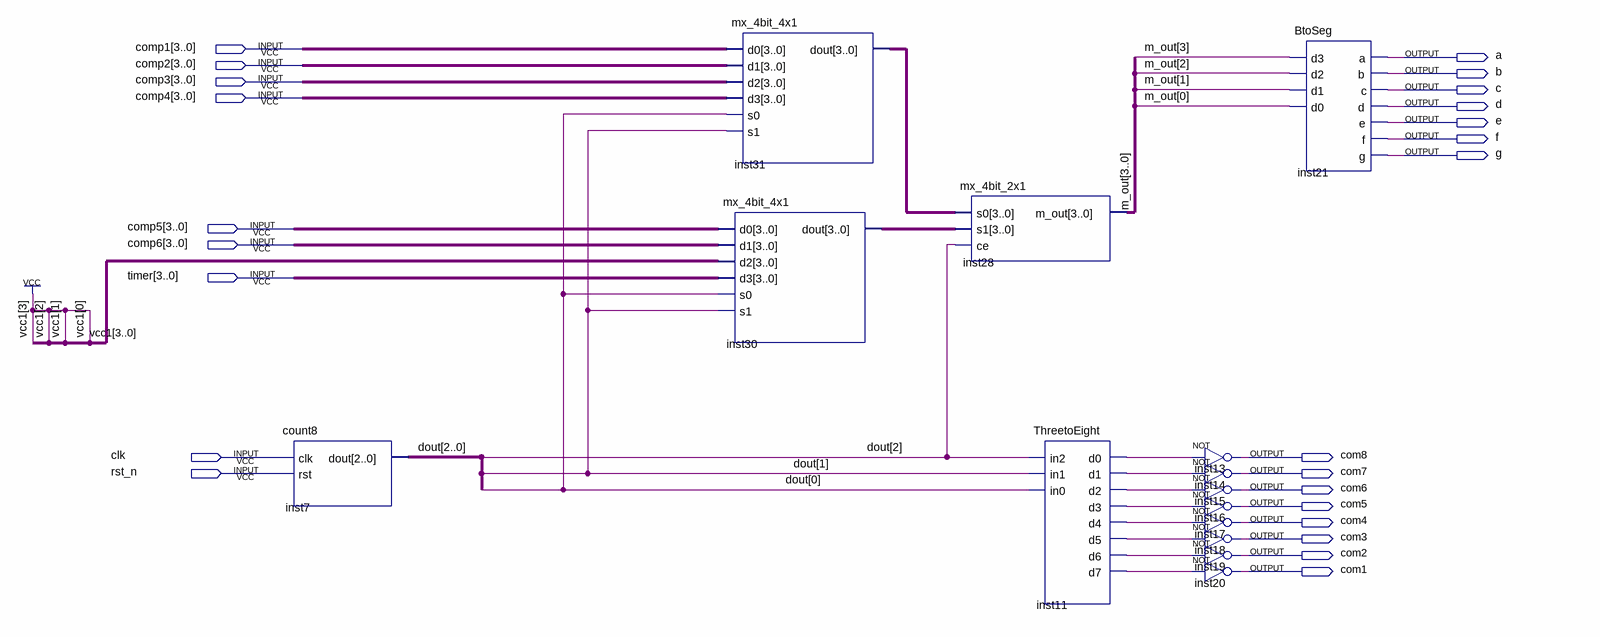
[diagram p0: schematic sheet]
// Quartus schematic segment.bdf as structural Verilog: 14 symbols, 24 pins
module segment (
  input  [3:0] comp1,
  input  [3:0] comp2,
  input  [3:0] comp3,
  input  [3:0] comp4,
  input  [3:0] comp5,
  input  [3:0] comp6,
  input  [3:0] timer,
  input  clk,
  input  rst_n,
  output a,
  output b,
  output c,
  output d,
  output e,
  output f,
  output g,
  output com8,
  output com7,
  output com6,
  output com5,
  output com4,
  output com3,
  output com2,
  output com1
);

  wire inst11_d0, inst11_d1, inst11_d2, inst11_d3, inst11_d4, inst11_d5, inst11_d6, inst11_d7;
  wire [2:0] dout;
  wire [3:0] inst30_dout, inst31_dout, m_out;

  count8 inst7 (.clk(clk), .rst(rst_n), .dout(dout));
  mx_4bit_4x1 inst31 (.d0(comp1), .d1(comp2), .d2(comp3), .d3(comp4), .s0(dout[0]), .s1(dout[1]), .dout(inst31_dout));
  mx_4bit_4x1 inst30 (.d0(comp5), .d1(comp6), .d2(4'b1111), .d3(timer), .s0(dout[0]), .s1(dout[1]), .dout(inst30_dout));
  mx_4bit_2x1 inst28 (.s0(inst31_dout), .s1(inst30_dout), .ce(dout[2]), .m_out(m_out));
  ThreetoEight inst11 (
    .in2(dout[2]), .in1(dout[1]), .in0(dout[0]), .d0(inst11_d0), .d1(inst11_d1), .d2(inst11_d2),
    .d3(inst11_d3), .d4(inst11_d4), .d5(inst11_d5), .d6(inst11_d6), .d7(inst11_d7));
  not inst13 (com8, inst11_d0);
  not inst14 (com7, inst11_d1);
  not inst15 (com6, inst11_d2);
  not inst16 (com5, inst11_d3);
  not inst17 (com4, inst11_d4);
  not inst18 (com3, inst11_d5);
  not inst19 (com2, inst11_d6);
  not inst20 (com1, inst11_d7);
  BtoSeg inst21 (
    .d3(m_out[3]), .d2(m_out[2]), .d1(m_out[1]), .d0(m_out[0]), .a(a), .b(b), .c(c), .d(d), .e(e), .f(f),
    .g(g));
endmodule
